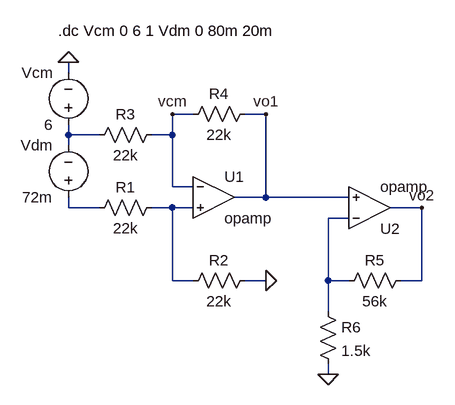
[diagram p0: schematic diffamp.asc]
diffamp.asc, the LTspice schematic file:
Version 4
SHEET 1 880 680
WIRE -64 -32 -64 -48
WIRE 128 32 96 32
WIRE 240 32 208 32
WIRE -64 64 -64 48
WIRE -16 64 -64 64
WIRE 96 64 96 32
WIRE 96 64 64 64
WIRE -64 80 -64 64
WIRE 96 144 96 64
WIRE 128 144 96 144
WIRE 240 160 240 32
WIRE 240 160 192 160
WIRE 368 160 240 160
WIRE -64 176 -64 160
WIRE -16 176 -64 176
WIRE 96 176 64 176
WIRE 128 176 96 176
WIRE 480 176 432 176
WIRE 368 192 336 192
WIRE 96 288 96 176
WIRE 128 288 96 288
WIRE 240 288 208 288
WIRE 336 288 336 192
WIRE 368 288 336 288
WIRE 480 288 480 176
WIRE 480 288 448 288
WIRE 336 336 336 288
WIRE 336 432 336 416
FLAG -64 -48 0
FLAG 240 32 vo1
FLAG 240 288 0
FLAG 96 32 vcm
FLAG 336 432 0
FLAG 480 176 vo2
SYMBOL voltage -64 64 R180
WINDOW 0 24 96 Left 2
WINDOW 3 24 16 Left 2
SYMATTR InstName Vcm
SYMATTR Value 6
SYMBOL voltage -64 176 R180
WINDOW 0 24 96 Left 2
WINDOW 3 24 16 Left 2
SYMATTR InstName Vdm
SYMATTR Value 72m
SYMBOL res 80 160 R90
WINDOW 0 0 56 VBottom 2
WINDOW 3 32 56 VTop 2
SYMATTR InstName R1
SYMATTR Value 22k
SYMBOL res 224 272 R90
WINDOW 0 0 56 VBottom 2
WINDOW 3 32 56 VTop 2
SYMATTR InstName R2
SYMATTR Value 22k
SYMBOL res -32 80 R270
WINDOW 0 32 56 VTop 2
WINDOW 3 0 56 VBottom 2
SYMATTR InstName R3
SYMATTR Value 22k
SYMBOL res 112 48 R270
WINDOW 0 32 56 VTop 2
WINDOW 3 0 56 VBottom 2
SYMATTR InstName R4
SYMATTR Value 22k
SYMBOL opamp 160 96 R0
SYMATTR InstName U1
SYMBOL opamp 400 240 M180
SYMATTR InstName U2
SYMBOL res 464 272 R90
WINDOW 0 0 56 VBottom 2
WINDOW 3 32 56 VTop 2
SYMATTR InstName R5
SYMATTR Value 56k
SYMBOL res 320 320 R0
SYMATTR InstName R6
SYMATTR Value 1.5k
TEXT -80 -96 Left 2 !.dc Vcm 0 6 1 Vdm 0 80m 20m

The netlist it stands for:
* diffamp.asc
Vcm N001 0 6
Vdm N002 N001 72m
R1 N003 N002 22k
R2 0 N003 22k
R3 N001 vcm 22k
R4 vcm vo1 22k
XU1 vcm N003 vo1 opamp Aol=100K GBW=10Meg  ; pins invin noninvin out
XU2 N004 vo1 vo2 opamp Aol=100K GBW=10Meg  ; pins invin noninvin out
R5 vo2 N004 56k
R6 N004 0 1.5k
.dc Vcm 0 6 1 Vdm 0 80m 20m
.backanno
.end